# EAGLE design Power_Amp_carlos.2 (EAGLE 7.4.0)
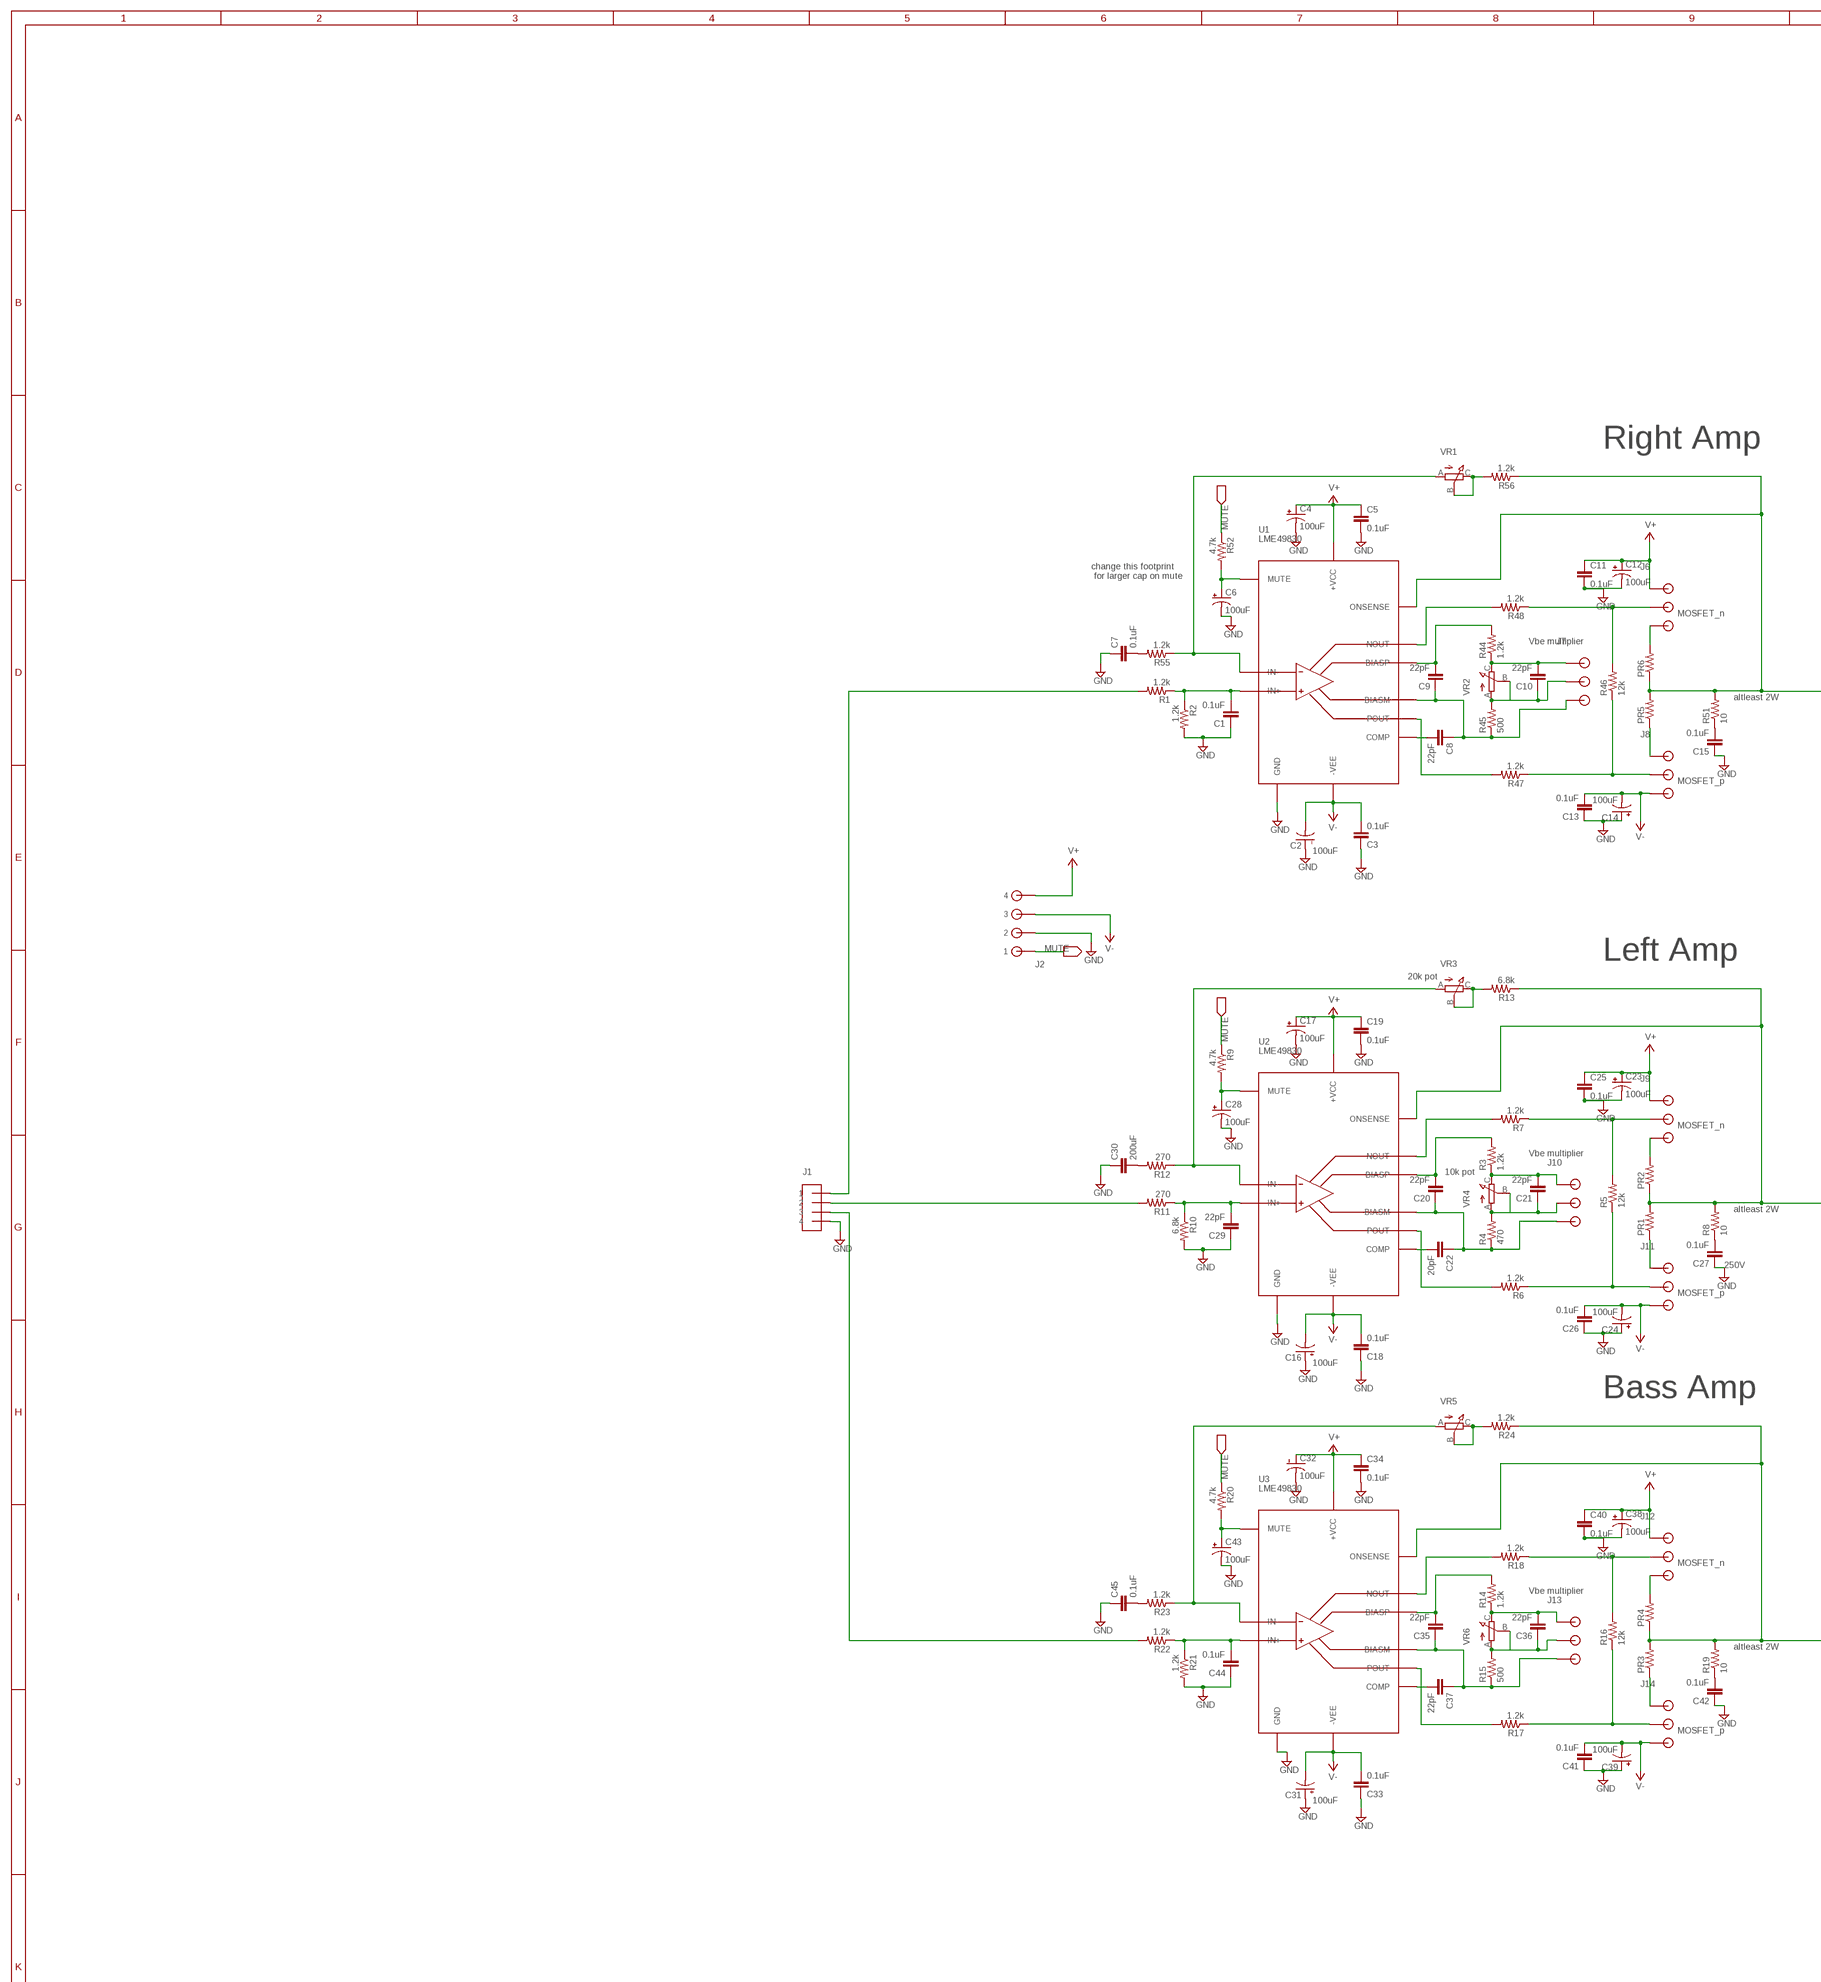
[diagram p0: schematic, sheet 1, part 1 of 3]
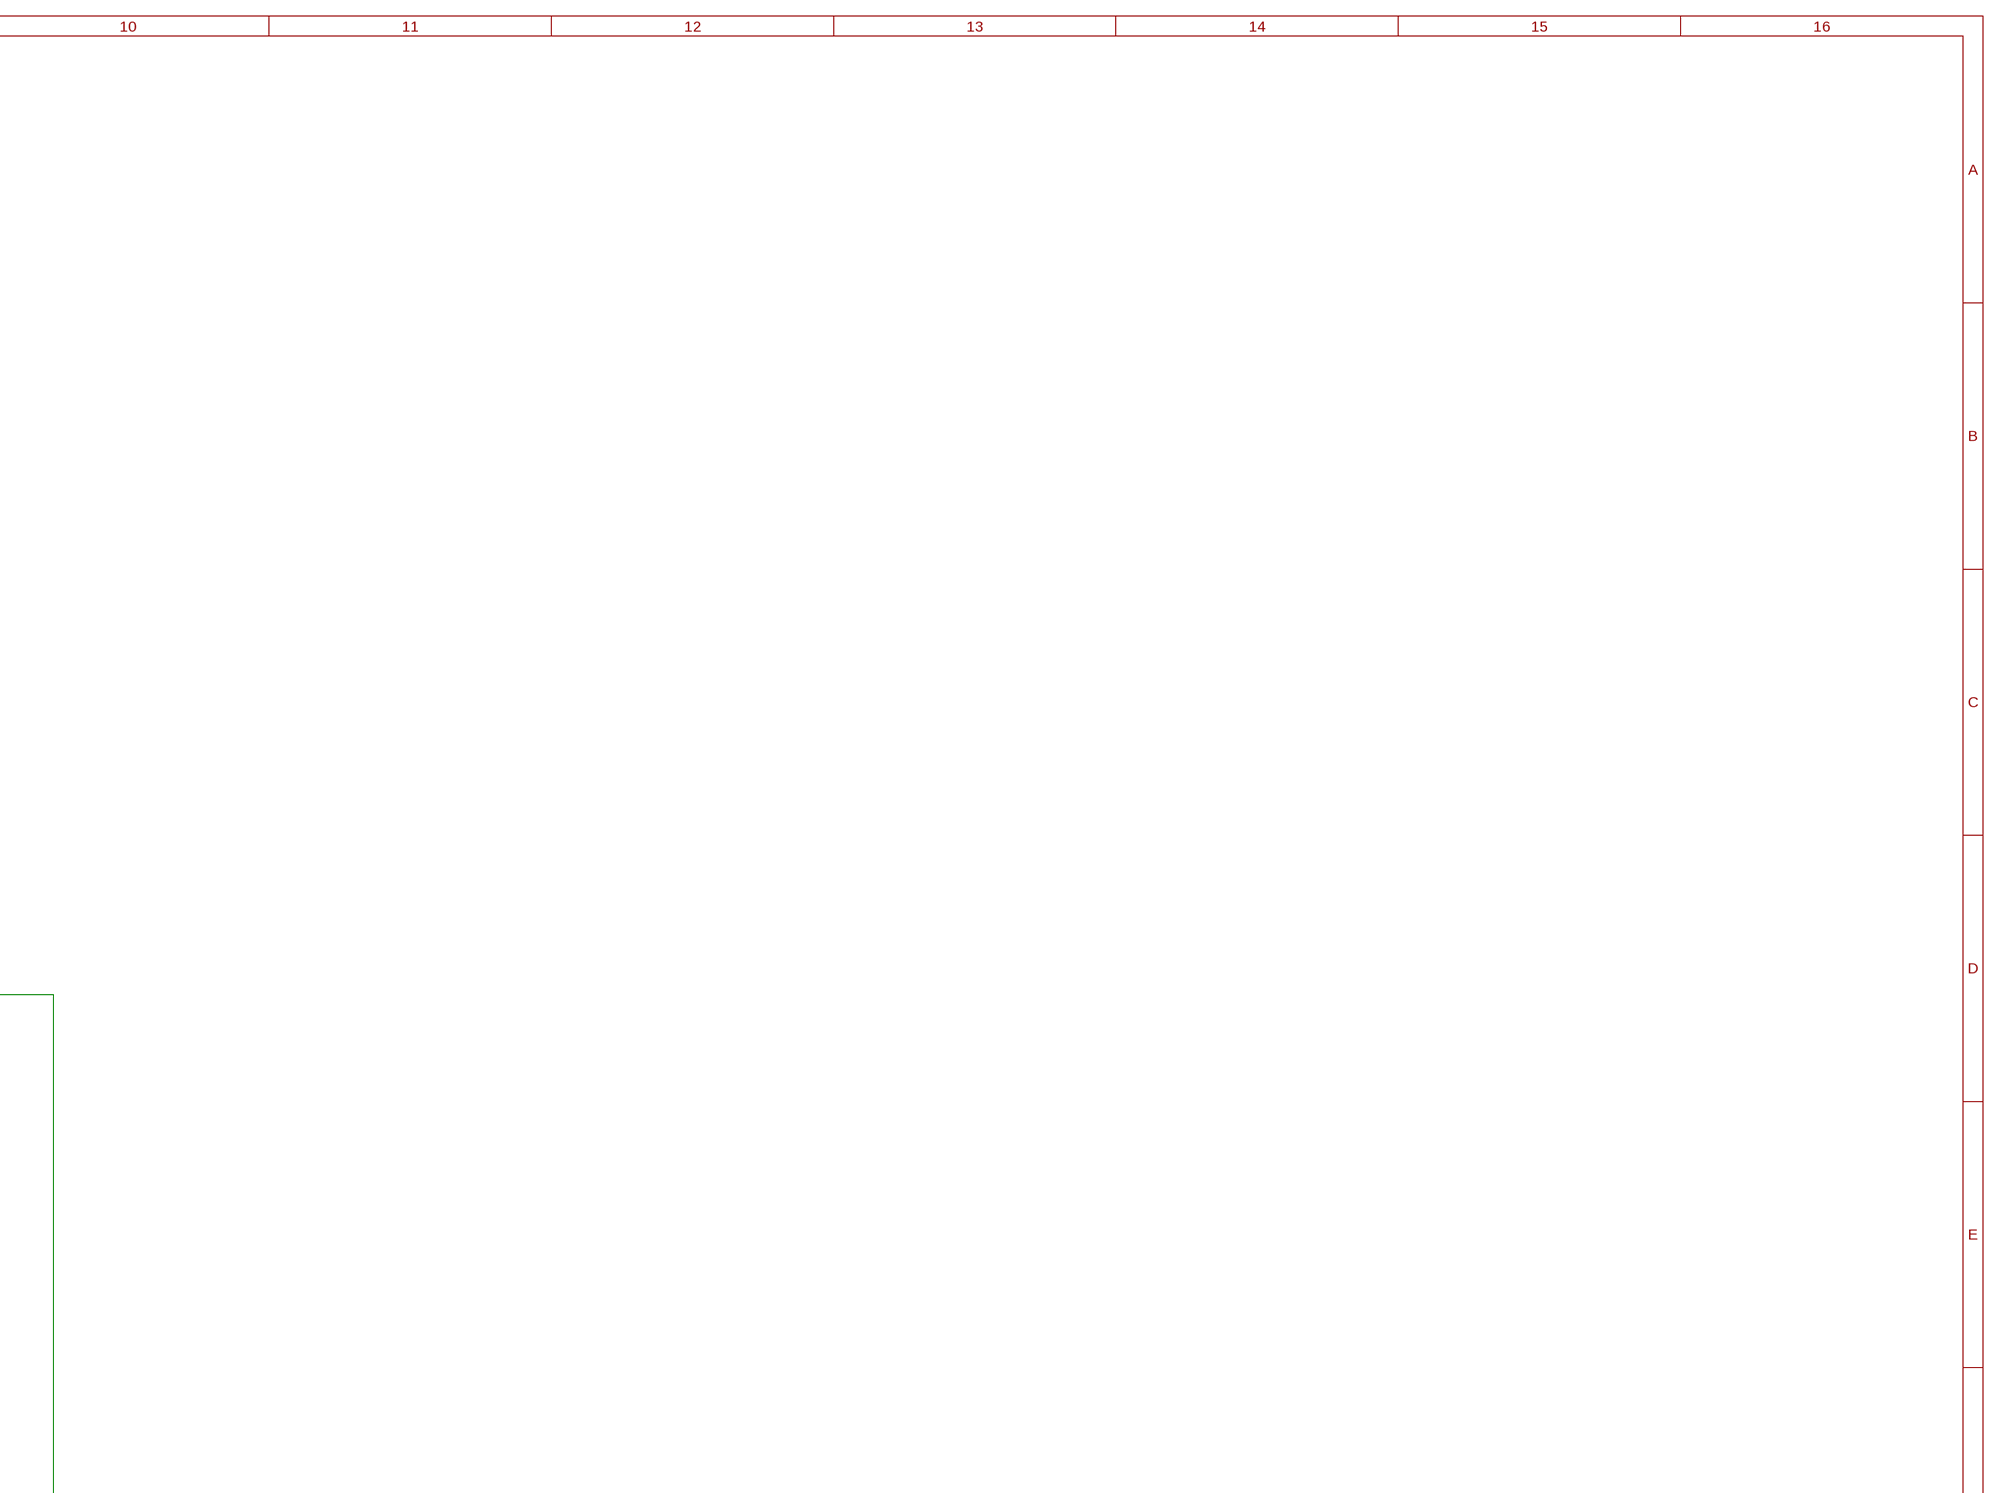
[diagram p1: schematic, sheet 1, part 2 of 3]
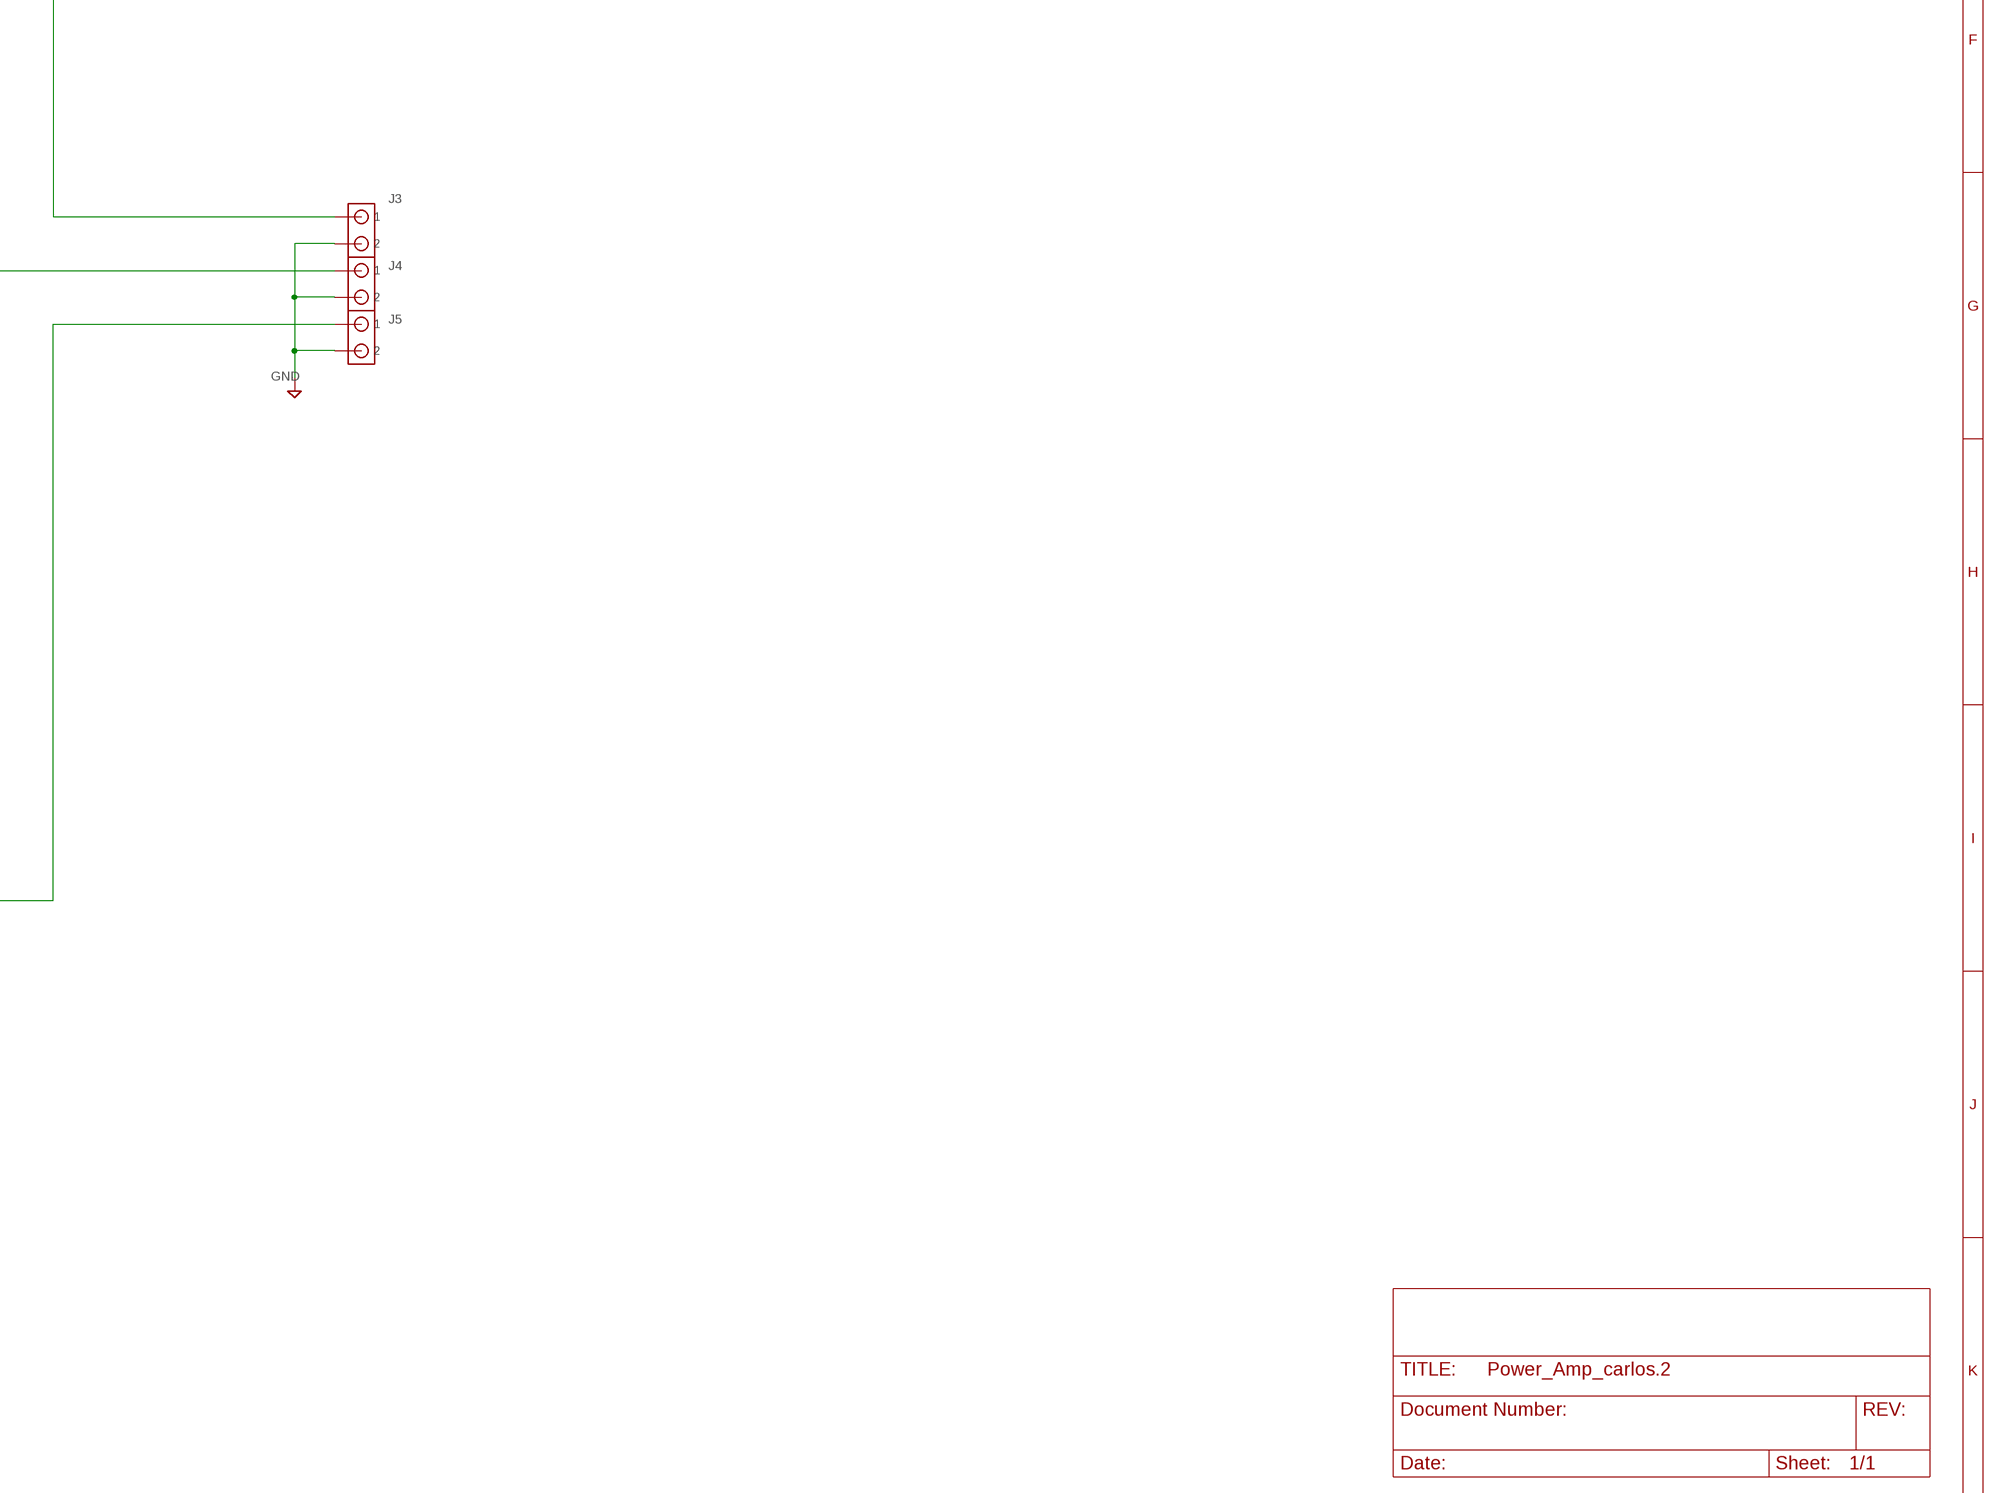
[diagram p2: schematic, sheet 1, part 3 of 3]

## Parts
C1  0.1uF  C-EU050-024X044  [C050-024X044]
C2  100uF  CPOL-USE2.5-6  [E2,5-6]
C3  0.1uF  C-EU050-024X044  [C050-024X044]
C4  100uF  CPOL-USE2.5-6  [E2,5-6]
C5  0.1uF  C-EU050-024X044  [C050-024X044]
C6  100uF  CPOL-USE2.5-6  [E2,5-6]
C7  0.1uF  C-EU050-024X044  [C050-024X044]
C8  22pF  C-EU050-024X044  [C050-024X044]
C9  22pF  C-EU050-024X044  [C050-024X044]
C10  22pF  C-EU050-024X044  [C050-024X044]
C11  0.1uF  C-EU050-024X044  [C050-024X044]
C12  100uF  CPOL-USE2.5-6  [E2,5-6]
C13  0.1uF  C-EU050-024X044  [C050-024X044]
C14  100uF  CPOL-USE2.5-6  [E2,5-6]
C15  0.1uF  C-EU050-024X044  [C050-024X044]
C16  100uF  CPOL-USE2.5-6  [E2,5-6]
C17  100uF  CPOL-USE2.5-6  [E2,5-6]
C18  0.1uF  C-EU050-024X044  [C050-024X044]
C19  0.1uF  C-EU050-024X044  [C050-024X044]
C20  22pF  C-EU050-024X044  [C050-024X044]
C21  22pF  C-EU050-024X044  [C050-024X044]
C22  20pF  C-EU050-024X044  [C050-024X044]
C23  100uF  CPOL-USE2.5-6  [E2,5-6]
C24  100uF  CPOL-USE2.5-6  [E2,5-6]
C25  0.1uF  C-EU050-024X044  [C050-024X044]
C26  0.1uF  C-EU050-024X044  [C050-024X044]
C27  0.1uF  C-EU050-024X044  [C050-024X044]
C28  100uF  CPOL-USE2.5-6  [E2,5-6]
C29  22pF  C-EU050-024X044  [C050-024X044]
C30  200uF  C-EU050-024X044  [C050-024X044]
C31  100uF  CPOL-USE2.5-6  [E2,5-6]
C32  100uF  CPOL-USE2.5-6  [E2,5-6]
C33  0.1uF  C-EU050-024X044  [C050-024X044]
C34  0.1uF  C-EU050-024X044  [C050-024X044]
C35  22pF  C-EU050-024X044  [C050-024X044]
C36  22pF  C-EU050-024X044  [C050-024X044]
C37  22pF  C-EU050-024X044  [C050-024X044]
C38  100uF  CPOL-USE2.5-6  [E2,5-6]
C39  100uF  CPOL-USE2.5-6  [E2,5-6]
C40  0.1uF  C-EU050-024X044  [C050-024X044]
C41  0.1uF  C-EU050-024X044  [C050-024X044]
C42  0.1uF  C-EU050-024X044  [C050-024X044]
C43  100uF  CPOL-USE2.5-6  [E2,5-6]
C44  0.1uF  C-EU050-024X044  [C050-024X044]
C45  0.1uF  C-EU050-024X044  [C050-024X044]
J1  4_PIN_AMPCONN  [4_PIN_AMPCON]
J2  1984633  [1984633]
J3  2TERMINAL_SPEAKER  [2TERMINAL_SPEAKER]
J4  2TERMINAL_SPEAKER  [2TERMINAL_SPEAKER]
J5  2TERMINAL_SPEAKER  [2TERMINAL_SPEAKER]
J6  OSTVN03A150  [OSTVN03A150]
J7  OSTVN03A150  [OSTVN03A150]
J8  OSTVN03A150  [OSTVN03A150]
J9  OSTVN03A150  [OSTVN03A150]
J10  OSTVN03A150  [OSTVN03A150]
J11  OSTVN03A150  [OSTVN03A150]
J12  OSTVN03A150  [OSTVN03A150]
J13  OSTVN03A150  [OSTVN03A150]
J14  OSTVN03A150  [OSTVN03A150]
PR1  R-US_0617/5V  [0617V]
PR2  R-US_0617/5V  [0617V]
PR3  R-US_0617/5V  [0617V]
PR4  R-US_0617/5V  [0617V]
PR5  R-US_0617/5V  [0617V]
PR6  R-US_0617/5V  [0617V]
R1  1.2k  R-US_0204/2V  [0204V]
R2  1.2k  R-US_0204/2V  [0204V]
R3  1.2k  R-US_0204/2V  [0204V]
R4  470  R-US_0204/2V  [0204V]
R5  12k  R-US_0204/2V  [0204V]
R6  1.2k  R-US_0204/2V  [0204V]
R7  1.2k  R-US_0204/2V  [0204V]
R8  10  R-US_0617/5V  [0617V]
R9  4.7k  R-US_0204/2V  [0204V]
R10  6.8k  R-US_0204/2V  [0204V]
R11  270  R-US_0204/2V  [0204V]
R12  270  R-US_0204/2V  [0204V]
R13  6.8k  R-US_0204/2V  [0204V]
R14  1.2k  R-US_0204/2V  [0204V]
R15  500  R-US_0204/2V  [0204V]
R16  12k  R-US_0204/2V  [0204V]
R17  1.2k  R-US_0204/2V  [0204V]
R18  1.2k  R-US_0204/2V  [0204V]
R19  10  R-US_0617/5V  [0617V]
R20  4.7k  R-US_0204/2V  [0204V]
R21  1.2k  R-US_0204/2V  [0204V]
R22  1.2k  R-US_0204/2V  [0204V]
R23  1.2k  R-US_0204/2V  [0204V]
R24  1.2k  R-US_0204/2V  [0204V]
R44  1.2k  R-US_0204/2V  [0204V]
R45  500  R-US_0204/2V  [0204V]
R46  12k  R-US_0204/2V  [0204V]
R47  1.2k  R-US_0204/2V  [0204V]
R48  1.2k  R-US_0204/2V  [0204V]
R51  10  R-US_0617/5V  [0617V]
R52  4.7k  R-US_0204/2V  [0204V]
R55  1.2k  R-US_0204/2V  [0204V]
R56  1.2k  R-US_0204/2V  [0204V]
U1  LME49830  [NDN0015A]
U2  LME49830  [NDN0015A]
U3  LME49830  [NDN0015A]
VR1  EVM2W  [EVM2W]
VR2  EVM2W  [EVM2W]
VR3  EVM2W  [EVM2W]
VR4  EVM2W  [EVM2W]
VR5  EVM2W  [EVM2W]
VR6  EVM2W  [EVM2W]

## Nets
BASS: J1.3 R22.2
GND: C1.1 C2.+ C3.1 C4.- C5.2 C6.- C7.1 C11.2 C12.- C13.1 C14.+ C15.1 C16.+ C17.- C18.1 C19.2 C23.- C24.+ C25.2 C26.1 C27.1 C28.- C29.1 C30.1 C31.+ C32.- C33.1 C34.2 C38.- C39.+ C40.2 C41.1 C42.1 C43.- C44.1 C45.1 J1.4 J2.P$2 J3.P$2 J4.P$2 J5.P$2 R2.2 R10.2 R21.2 U1.P3(GND) U2.P3(GND) U3.P3(GND)
LEFT: J1.2 R11.2
MUTE: J2.P$1 R9.1 R20.1 R52.1
N$1: C21.2 J10.P$1 R3.1 VR4.C
N$2: C21.1 J10.P$2 R4.2 VR4.A VR4.B
N$3: C20.2 R3.2 U2.P12(BIASP)
N$4: R48.2 U1.P14(NOUT)
N$5: C20.1 C22.1 J10.P$3 R4.1 U2.P11(BIASM)
N$6: C22.2 U2.P6(COMP)
N$7: R6.2 U2.P13(POUT)
N$8: J9.P$2 R5.2 R7.1
N$9: J11.P$2 R5.1 R6.1
N$11: J9.P$3 PR2.2
N$12: J4.P$1 PR1.2 PR2.1 R8.2 R13.1 U2.P$8(ONSENSE)
N$13: C27.2 R8.1
N$14: C28.+ R9.2 U2.P2(MUTE)
N$15: R7.2 U2.P14(NOUT)
N$16: C1.2 R1.1 R2.1 U1.P4(IN+)
N$17: C29.2 R10.1 R11.1 U2.P4(IN+)
N$18: C30.2 R12.2
N$19: R12.1 U2.P5(IN-) VR3.A
N$20: R13.2 VR3.B VR3.C
N$22: J11.P$1 PR1.1
N$23: C36.2 J13.P$1 R14.1 VR6.C
N$24: C36.1 J13.P$2 R15.2 VR6.A VR6.B
N$25: C35.2 R14.2 U3.P12(BIASP)
N$26: C35.1 C37.1 J13.P$3 R15.1 U3.P11(BIASM)
N$27: C37.2 U3.P6(COMP)
N$28: R17.2 U3.P13(POUT)
N$30: J12.P$2 R16.2 R18.1
N$31: R55.1 U1.P5(IN-) VR1.A
N$32: J14.P$2 R16.1 R17.1
N$33: J12.P$3 PR4.2
N$35: C42.2 R19.1
N$36: C7.2 R55.2
N$37: C43.+ R20.2 U3.P2(MUTE)
N$38: R18.2 U3.P14(NOUT)
N$39: C44.2 R21.1 R22.1 U3.P4(IN+)
N$40: R56.2 VR1.B VR1.C
N$41: C45.2 R23.2
N$42: R23.1 U3.P5(IN-) VR5.A
N$43: R24.2 VR5.B VR5.C
N$45: J14.P$1 PR3.1
N$65: C10.2 J7.P$1 R44.1 VR2.C
N$66: C8.2 U1.P6(COMP)
N$67: C8.1 C9.1 J7.P$3 R45.1 U1.P11(BIASM)
N$68: C10.1 J7.P$2 R45.2 VR2.A VR2.B
N$69: C9.2 R44.2 U1.P12(BIASP)
N$70: R47.2 U1.P13(POUT)
N$72: J6.P$2 R46.2 R48.1
N$73: J8.P$2 R46.1 R47.1
N$74: J6.P$3 PR6.2
N$75: J3.P$1 PR5.2 PR6.1 R51.2 R56.1 U1.P$8(ONSENSE)
N$77: J5.P$1 PR3.2 PR4.1 R19.2 R24.1 U3.P$8(ONSENSE)
N$84: C15.2 R51.1
N$85: C6.+ R52.2 U1.P2(MUTE)
N$110: J8.P$1 PR5.1
RIGHT: J1.1 R1.2
V+: C4.+ C5.1 C11.1 C12.+ C17.+ C19.1 C23.+ C25.1 C32.+ C34.1 C38.+ C40.1 J2.P$4 J6.P$1 J9.P$1 J12.P$1 U1.P15(+VCC) U2.P15(+VCC) U3.P15(+VCC)
V-: C2.- C3.2 C13.2 C14.- C16.- C18.2 C24.- C26.2 C31.- C33.2 C39.- C41.2 J2.P$3 J8.P$3 J11.P$3 J14.P$3 U1.P10(-VEE) U2.P10(-VEE) U3.P10(-VEE)

## Notes on the sheet
- Right Amp
- change this footprint
   for larger cap on mute
- MOSFET_n
- Vbe multiplier
- altleast 2W
- MOSFET_p
- Left Amp
- 20k pot
- MOSFET_n
- Vbe multiplier
- 10k pot
- altleast 2W
- 250V
- MOSFET_p
- Bass Amp
- MOSFET_n
- Vbe multiplier
- altleast 2W
- MOSFET_p

## Library data of the parts
C1 C3 C5 C7-C11 C13 C15 C18-C22 C25-C27 C29 C30 C33-C37 C40-C42 C44 C45 = rcl:C-EU: CAPACITOR, European symbol
C2 C4 C6 C12 C14 C16 C17 C23 C24 C28 C31 C32 C38 C39 C43 = rcl:CPOL-US: POLARIZED CAPACITOR, American symbol
J1 = Amplifier_Parts:4_PIN_AMPCONN
J2 = Amplifier_Parts:1984633
J3-J5 = Amplifier_Parts:2TERMINAL_SPEAKER
J6-J14 = Amplifier_Parts:OSTVN03A150
PR1-PR6 R1-R24 R44-R48 R51 R52 R55 R56 = rcl:R-US_: RESISTOR, American symbol
U1-U3 = LME49830_1:LME49830: Mono High Fidelity 200 Volt MOSFET Power Amplifier Input Stage with Mute Datasheet: http://www.ti.com/lit/ds/symlink/lme49830.pdf
VR1-VR6 = Amplifier_Parts:EVM2W

## Board
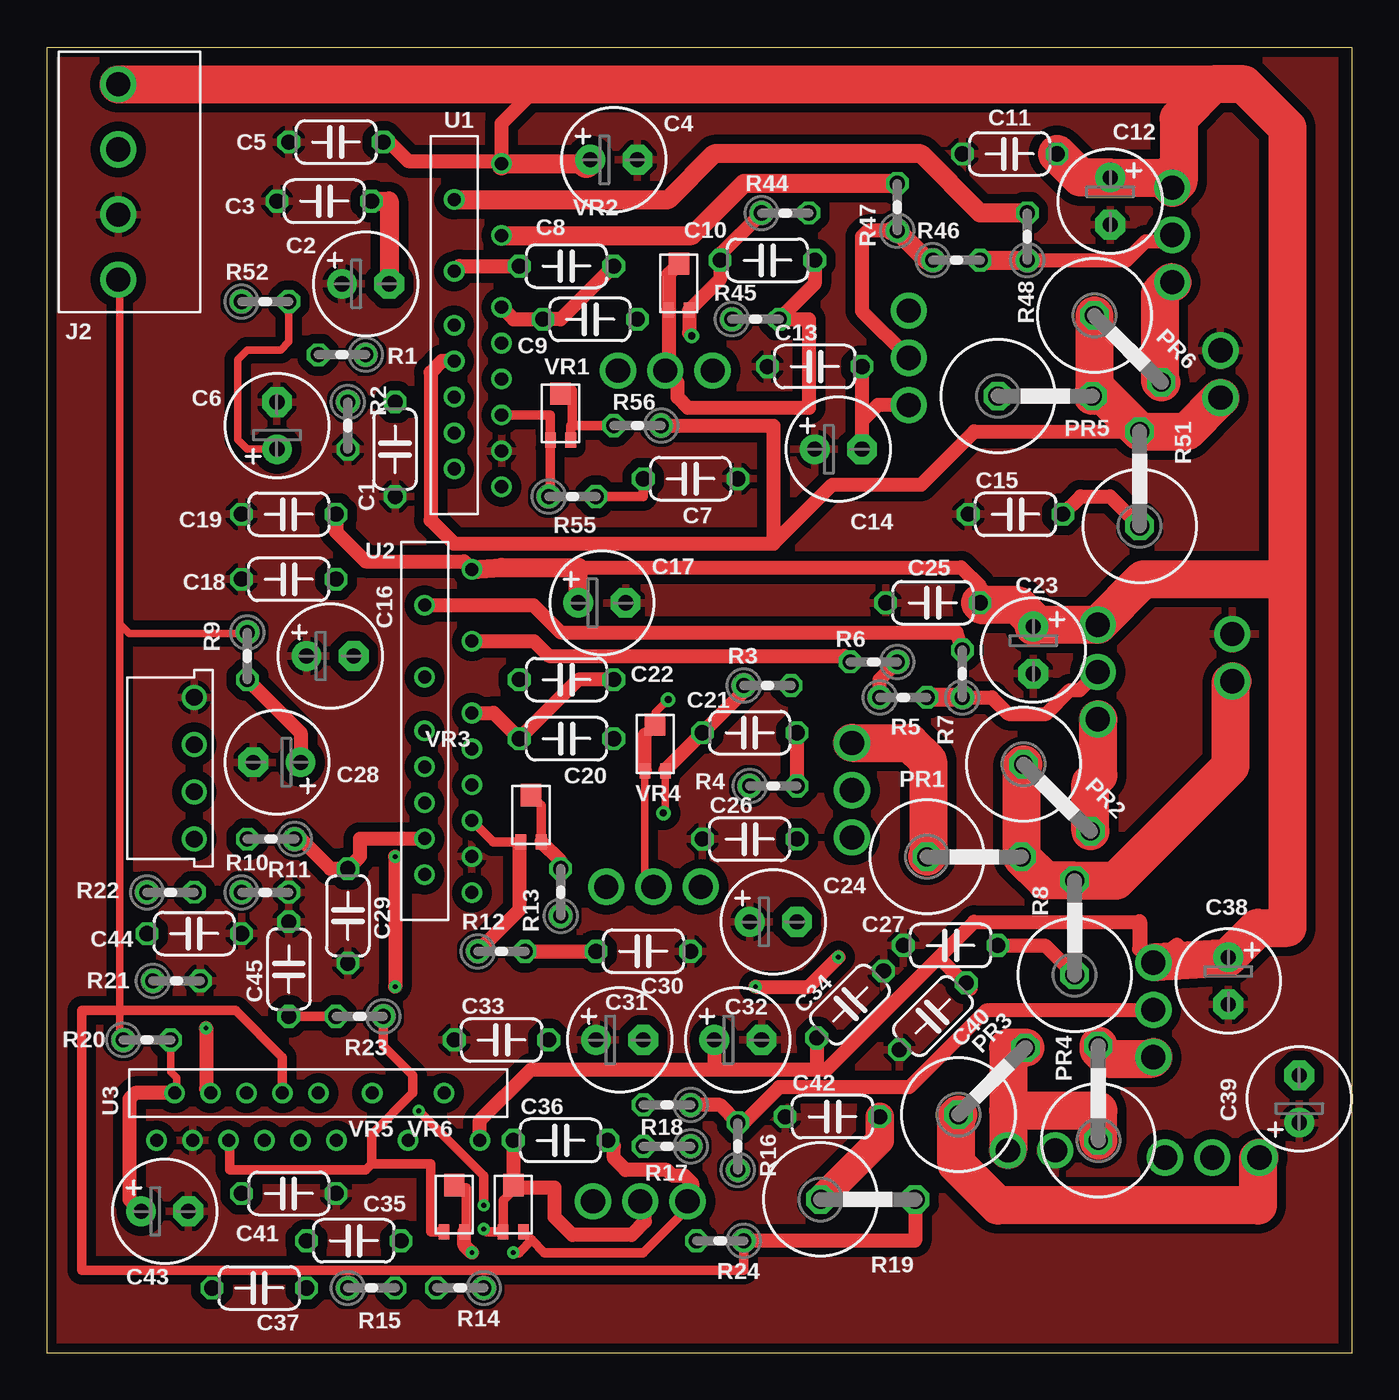
[diagram p3: board, top side]
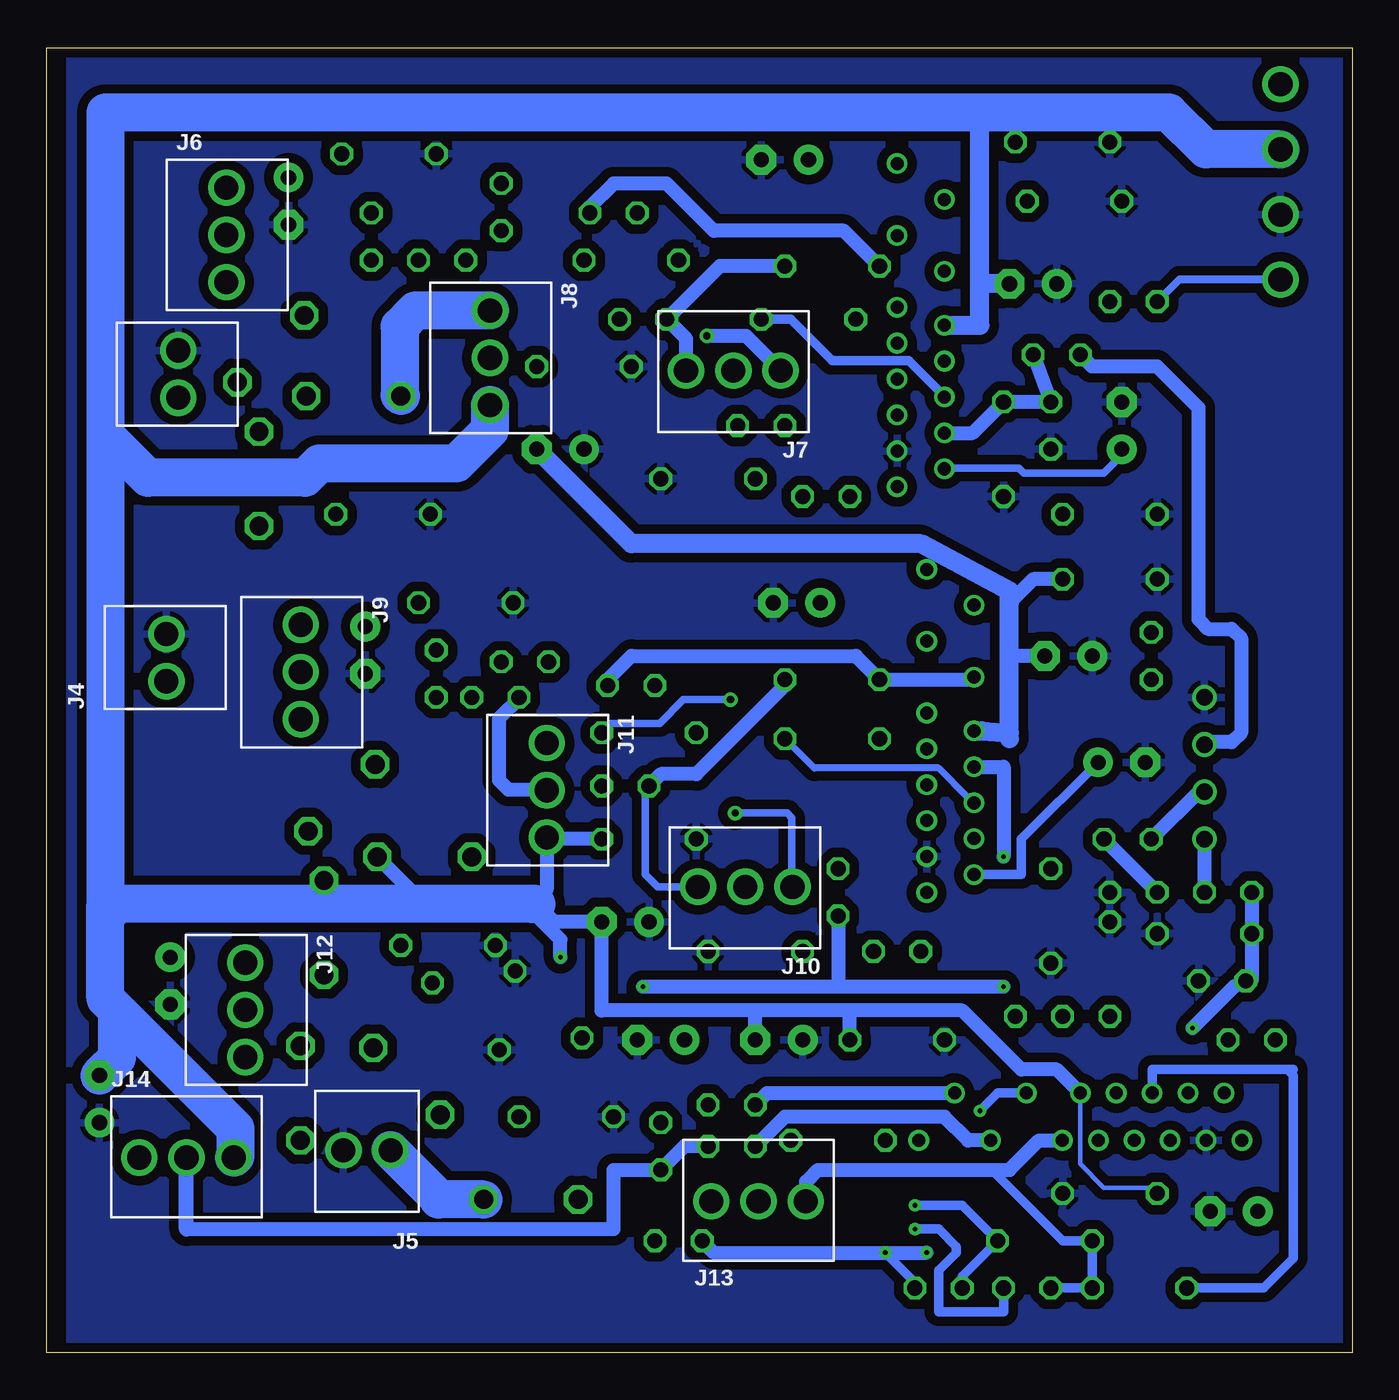
[diagram p4: board, bottom side, seen from below]

Size 70.16 x 70.16 mm. Coordinates in mm from the lower left corner, seen from the top.
Outline: 0,0 70.16,0 70.16,70.16 0,70.16 0,0
Copper layers (1*16): Top 0.0178mm / dielectric 59mil / Bottom 0.0178mm
Design rules "epl-lpkf": minimum track width 8mil, minimum drill 0.35mm, track to track 8mil, track to pad 8mil, pad to pad 8mil, via to via 8mil, smd to smd 8mil, copper to edge 15mil, drill to drill 15mil, minimum pad ring 8mil, minimum via ring 8mil, stop-mask expansion 3mil, vias tented up to drill 0mil, thermal gap 10mil

### Footprints (pad centres in the part's own frame; a part is rotated, then mirrored left to right if it is on the bottom)
C050-024X044 = drill 0.813 octagon: 1 -2.54,0; 2 2.54,0
E2,5-6 = drill 0.813 pad 1.6: + -1.27,0 | drill 0.813 pad 1.6 octagon: - 1.27,0
4_PIN_AMPCON = drill 0.89: 1 1.27,0; 2 -1.27,0; 3 -3.81,0; 4 3.81,0
1984633 = drill 1.3: P$1 1.75,4.4; P$2 5.25,4.4; P$3 8.75,4.4; P$4 12.25,4.4
2TERMINAL_SPEAKER = drill 1.3: P$1 1.5,3.2; P$2 4.04,3.2
OSTVN03A150 = drill 1.3: P$1 1.5,3.2; P$2 4.04,3.2; P$3 6.58,3.2
0617V = drill 1.016 octagon: 1 -2.54,0; 2 2.54,0
0204V = drill 0.813 octagon: 1 -1.27,0; 2 1.27,0
NDN0015A = drill 0.7: P1 5.08,-8.685; P2 2.54,-7.72; P3 5.08,-6.755; P4 2.54,-5.79; P5 5.08,-4.825; P6 2.54,-3.86; P7 5.08,-2.895; P9 5.08,-0.965; P10 2.54,0; P11 5.08,0.965; P12 2.54,2.895; P13 5.08,4.825; P14 2.54,6.755; P15 5.08,8.685; P$8 2.54,-1.93
EVM2W = smd 0.575 x 0.8: A -0.55,-1.1; C 0.55,-1.1 | smd 1.1 x 1.2: B 0,1.4

### Placement (x,y rotation side)
C1  18.73,48.58 90 top
C2  17.14,57.47 0 top
C3  14.92,61.91 0 top
C4  30.48,64.14 0 top
C5  15.56,65.09 180 top
C6  12.38,49.85 90 top
C7  34.61,46.99 180 top
C8  29.21,55.56 0 top
C9  27.94,58.42 180 top
C10  38.73,58.74 180 top
C11  51.75,64.45 180 top
C12  57.15,61.91 270 top
C13  41.27,53.02 0 top
C14  42.55,48.58 0 top
C15  52.07,45.09 0 top
C16  15.24,37.46 0 top
C17  29.84,40.32 0 top
C18  13.02,41.59 0 top
C19  13.02,45.09 180 top
C20  27.94,36.2 180 top
C21  37.78,33.34 180 top
C22  27.94,33.02 0 top
C23  53.02,37.78 270 top
C24  39.05,23.18 0 top
C25  47.62,40.32 180 top
C26  37.78,27.62 0 top
C27  48.58,21.91 0 top
C28  12.38,31.75 180 top
C29  16.19,23.5 90 top
C30  32.07,21.59 180 top
C31  30.8,16.83 0 top
C32  37.15,16.83 0 top
C33  24.45,16.83 0 top
C34  43.18,18.73 45 top
C35  16.51,6.03 0 top
C36  27.62,11.43 0 top
C37  11.43,3.49 180 top
C38  63.5,20 270 top
C39  67.31,13.65 90 top
C40  47.62,18.1 225 top
C41  13.02,8.57 180 top
C42  42.23,12.7 0 top
C43  6.35,7.62 0 top
C44  7.94,22.54 180 top
C45  13.02,20.64 270 top
J1  7.94,31.43 90 top
J2  8.25,55.94 90 top
J3  59.88,49.85 90 bottom
J4  60.52,34.61 90 bottom
J5  50.16,14.1 180 bottom
J6  63.69,64.14 270 bottom
J7  29.21,56.01 180 bottom
J8  49.53,57.53 270 bottom
J9  59.69,40.64 270 bottom
J10  28.57,28.26 180 bottom
J11  46.48,34.29 270 bottom
J12  62.67,22.48 270 bottom
J13  35.94,4.95 0 bottom
J14  66.68,7.3 0 bottom
PR1  49.85,26.67 0 top
PR2  54.29,29.84 315 top
PR3  50.8,14.6 45 top
PR4  56.51,13.97 90 top
PR5  53.66,51.44 0 top
PR6  58.1,53.98 315 top
R1  15.88,53.66 180 top
R2  16.19,49.85 270 top
R3  38.73,35.88 0 top
R4  39.05,30.48 0 top
R5  46.04,35.24 0 top
R6  44.45,37.15 180 top
R7  49.21,36.51 90 top
R8  55.24,22.86 90 top
R9  10.79,37.46 270 top
R10  11.75,24.77 0 top
R11  12.06,27.62 180 top
R12  24.45,21.59 0 top
R13  27.62,24.77 90 top
R14  22.23,3.49 180 top
R15  17.46,3.49 0 top
R16  37.15,11.11 90 top
R17  33.34,11.11 180 top
R18  33.34,13.33 180 top
R19  44.13,8.25 0 top
R20  5.4,16.83 0 top
R21  6.98,20 0 top
R22  6.67,24.77 0 top
R23  16.83,18.1 180 top
R24  36.2,6.03 180 top
R44  39.69,61.28 0 top
R45  38.1,55.56 0 top
R46  48.89,58.74 0 top
R47  45.72,61.59 90 top
R48  52.71,60.01 90 top
R51  58.74,46.99 90 top
R52  11.75,56.52 0 top
R55  28.26,46.04 0 top
R56  31.75,49.85 180 top
U1  19.37,55.24 0 top
U2  17.78,33.44 0 top
U3  14.61,16.51 270 top
VR1  27.62,50.16 0 top
VR2  33.97,57.15 0 top
VR3  26.03,28.57 0 top
VR4  32.7,32.38 0 top
VR5  21.91,7.62 0 top
VR6  25.08,7.62 0 top

### Tracks (layer width: path | path; a pad name or v marks a point on that pad's centre or on a via)
BASS
  Bottom 0.762: J1.3 R22.2
GND
  pour Top (isolate 0.508): 0.32,-0.32 69.22,-0.95 69.22,70.17 0.32,70.8
  pour Bottom (isolate 0.508): 0.32,-0.64 68.9,-0.95 68.9,70.17 0.32,70.48
LEFT
  Bottom 0.762: J1.2 8.25,30.16 R11.2
MUTE
  Top 0.406: R9.1 10.73,38.67 4.45,38.67 3.94,39.18 | 3.94,39.18 3.94,17.02 R20.1 | 3.94,39.18 3.94,57.61 J2.P$1
  Bottom 0.406: J2.P$1 9.3,57.69 R52.1 9.27,57.72 3.94,57.72
N$1  (via drill 0.38)
  Top 0.406: VR4.C 33.25,29.13 v33.15,29.02
  Top 0.762: R3.1 37.46,35.56 C21.2 33.25,31.35 VR4.C
  Bottom 0.406: v33.15,29.02 30.35,29.02 30.1,28.77 30.1,25.08 J10.P$1
N$2  (via drill 0.38)
  Top 0.381: 32.15,33.24 VR4.B
  Top 0.406: VR4.A 32.13,31.28 32.13,25.54 J10.P$2 | VR4.B 32.7,34.42 v33.4,35.12
  Top 0.762: VR4.A 32.15,33.24 | C21.1 R4.2
  Bottom 0.406: v33.4,35.12 35.94,35.12 37.21,33.85 39.81,33.85 C21.1
N$3
  Bottom 0.762: R3.2 40.01,36.2 38.73,37.46 26.67,37.46 C20.2 20.46,36.2 U2.P12
N$4
  Top 1.016: U1.P14 33.42,62 35.88,64.45 46.99,64.45 50.16,61.28 R48.2
N$5
  Top 0.762: U2.P11 24.02,34.4 C22.1 28.57,36.2 C20.1
  Bottom 0.406: J10.P$3 37.31,25.06 37.97,25.72 37.97,30.29 R4.1
  Bottom 0.762: C20.1 30.48,35.88 35.24,31.12 37.15,31.12 R4.1
N$6
  Bottom 0.381: 20.32,29.84 20.64,29.84 22.23,31.43 28.89,31.43 C22.2
  Bottom 0.508: U2.P6 20.32,29.84
N$7
  Top 0.762: U2.P13 26.19,38.26 26.99,37.46 42.86,37.46 R6.2
N$8
  Top 0.762: R7.1 50.8,35.24 51.69,34.35 53.72,34.35 54.99,35.62 55.51,35.62 J9.P$2
  Top 1.016: R7.1 R5.2
N$9
  Top 0.762: R5.1 44.77,36.2 R6.1
  Bottom 0.762: R5.1 44.77,35.18 45.85,34.1 45.85,30.8 45.34,30.29 43.32,30.29 J11.P$2
N$11
  Top 2.032: PR2.2 56.09,30.63 56.51,31.05 56.51,34.03 J9.P$3
N$12  (via drill 0.25)
  Top 0.762: v18.73,26.67 v18.73,19.68 | v38.1,19.68 40.96,19.68 v42.55,21.27
  Top 2.032: PR2.1 52.39,31.53 PR1.2 53.66,25.4 R8.2 57.47,25.4 63.63,31.56 63.63,36.02 J4.P$1
  Bottom 0.762: v18.73,19.68 27.62,19.68 | R13.1 27.62,19.68 | PR1.2 49.85,24.13 44.45,24.13 42.55,22.22 v42.55,21.27 | U2.P$8 18.73,31.51 v18.73,26.67 | 27.62,19.68 v38.1,19.68
N$13
  Top 0.762: C27.2 53.66,21.91 R8.1
N$14
  Top 0.762: R9.2 13.65,33.34 C28.+
  Bottom 0.508: U2.P2 17.78,25.72 17.78,27.62 C28.+
N$15
  Top 0.762: R7.2 48.89,38.74 27.62,38.74 26.16,40.19 U2.P14
N$16
  Bottom 0.762: R1.1 R2.1 C1.2 20.39,49.45 U1.P4
N$17
  Top 0.762: R11.1 13.65,27.62 15.24,26.04 C29.2 16.85,26.7 16.85,27.65 U2.P4
  Bottom 0.762: R11.1 R10.1
N$18
  Top 0.762: R12.2 C30.2
N$19
  Top 0.508: 25.4,27.39 VR3.A 24,27.47 U2.P5
  Top 0.762: 25.4,27.39 25.4,23.81 R12.1
N$20
  Top 0.508: VR3.C 26.59,29.43 VR3.B
  Top 0.762: R13.2 27.62,26.44 VR3.C
N$22
  Top 2.032: J11.P$1 46.39,32.79 47.37,31.81 47.37,26.73 PR1.1
N$23  (via drill 0.25)
  Top 0.508: VR6.C 26.08,6.07 | 26.08,6.07 26.76,5.4 32.07,5.4 34.7,8.02 | v25.08,5.4 25.4,5.4 26.08,6.07
  Top 0.762: C36.2 30.48,11.11 30.48,10.48 31.12,9.84 33.34,9.84 33.66,9.52 34.29,9.52 34.7,9.12 34.7,8.41 J13.P$1 34.57,8.02 34.7,8.02
  Bottom 0.508: R14.1 23.49,3.81 v25.08,5.4
N$24  (via drill 0.25)
  Top 0.508: 25.21,8.89 24.53,8.21 VR6.A 23.64,6.52 v23.49,6.67
  Top 0.762: C36.1 VR6.B 25.21,8.89 27.3,8.89 27.3,7.3 28.26,6.35 31.43,6.35 32.16,7.07 32.16,7.9 J13.P$2
  Bottom 0.508: v23.49,6.67 22.23,6.67 21.27,5.72 21.27,5.4 22.23,4.44 22.23,2.22 18.73,2.22 R15.2
N$25  (via drill 0.25)
  Top 0.508: v20,13.02 23.49,9.52 v23.49,7.94
  Bottom 0.508: U3.P12 19.05,13.97 v20,13.02 | v23.49,7.94 20.95,7.94 C35.2 20.95,4.13 R14.2
N$26
  Bottom 0.508: 19.37,9.84 15.56,6.03 C35.1 C37.1 R15.1
  Bottom 0.762: U3.P11 16.83,11.43 18.41,9.84 19.37,9.84 28.7,9.84 29.34,9.21 29.34,8.18 J13.P$3
N$27
  Bottom 0.508: U3.P6 10.74,15.24 3.49,15.24 | 3.49,15.24 3.18,15.24 | C37.2 4.76,3.49 3.18,5.08 3.18,14.92 3.49,15.24
N$28
  Bottom 0.762: U3.P13 20.64,11.43 21.91,12.7 30.48,12.7 R17.2
N$30
  Top 0.406: 59.17,18.41 59.45,18.41 J12.P$2
  Top 0.762: 59.17,18.41 50.48,18.41 46.35,14.29 39.37,14.29 37.46,12.38 R16.2 36.2,13.33 R18.1
N$31
  Top 0.508: U1.P5 27.07,50.42 VR1.A 27.07,46.04 R55.1
N$32
  Bottom 0.762: R17.1 35.88,11.11 R16.1 39.69,9.84 39.69,6.67 62.63,6.67
  Bottom 0.813: 62.63,6.67 J14.P$2
N$33
  Top 2.032: PR4.2 56.51,16.32 57.02,15.81 59.39,15.81 J12.P$3
N$35
  Top 1.524: R19.1 44.77,11.43 C42.2
N$36
  Top 0.508: R55.2 32.07,46.04 C7.2
N$37
  Top 0.406: R20.2 6.67,15.11 6.98,14.8 6.98,14.07 U3.P2
  Top 0.762: U3.P2 4.76,13.97 4.45,13.65 4.45,8.25 C43.+
N$38
  Bottom 0.762: R18.2 31.43,13.97 U3.P14
N$39  (via drill 0.25)
  Top 0.762: v8.57,17.46 8.57,14.21 U3.P4
  Bottom 0.762: R22.1 C44.2 5.4,20 R21.1 6.35,19.68 v8.57,17.46
N$40
  Top 0.508: R56.2 28.26,49.85 | VR1.C 28.17,49.85 28.26,49.85 | 28.26,49.85 28.26,51.75 27.62,51.75 VR1.B
N$41
  Top 0.508: C45.2 R23.2
N$42
  Top 0.508: R23.1 18.1,16.51 19.69,14.92 19.69,13.97 17.46,11.75 17.46,10.16 | 17.46,10.16 17.14,9.84 9.84,9.84 9.84,11.37 U3.P5 | VR5.A 20.64,6.52 20.64,10.16 17.46,10.16
N$43  (via drill 0.25)
  Top 0.508: VR5.C 22.54,6.52 22.54,8.89 21.91,8.89 VR5.B
  Top 0.762: v22.86,5.4 22.46,5.8 VR5.C
  Bottom 0.762: R24.2 34.29,5.4 v22.86,5.4
N$45
  Top 2.032: PR3.1 48.89,12.7 48.89,10.16 51.12,7.94 65.09,7.94 65.09,10.45 J14.P$1
N$65  (via drill 0.38)
  Top 0.762: R44.1 36.2,59.06 C10.2 36.2,57.72 VR2.C 34.52,54.82 v34.67,54.67
  Bottom 0.762: v34.67,54.67 32.58,54.67 J7.P$1
N$66
  Bottom 0.508: 21.91,51.44 23.81,53.34 27.94,53.34 30.16,55.56 C8.2
  Bottom 1.016: U1.P6 21.91,51.44
N$67
  Top 0.762: U1.P11 25.09,55.56 C8.1 27.62,55.56 C9.1
  Bottom 0.762: C9.1 33.97,58.42 R45.1 35.79,54.52 J7.P$3
N$68
  Top 0.762: C10.1 41.27,57.47 R45.2 40.96,55.56 40.96,50.8 34.48,50.8 33.91,51.37 33.91,52.15 J7.P$2 33.42,52.98 VR2.A 33.42,58 VR2.B
N$69
  Top 0.762: U1.P12 22.19,58.42 C9.2
  Bottom 0.762: C9.2 27.3,60.33 34.29,60.33 36.83,62.87 39.69,62.87 40.96,61.59 R44.2
N$70
  Top 1.016: U1.P13 34.67,60.07 37.46,62.87 R47.2
N$72
  Top 0.762: R48.1 58.04,58.74 59.05,59.75 60.15,59.75 J6.P$2
  Top 1.016: R46.2 R48.1
N$73
  Top 0.762: 45.4,60.33 44.13,60.33 43.81,60.01 43.81,56.01 J8.P$2
  Top 1.016: R46.1 47.31,58.74 R47.1 45.4,60.33
N$74
  Top 2.032: J6.P$3 60.41,57.56 59.82,56.96 59.82,52.26 PR6.2
N$75
  Top 0.762: U1.P$8 21.25,53.31 20.64,52.7 20.64,44.77 21.91,43.5 39.05,43.5 | R56.1 39.05,49.85 39.05,43.5 | 39.05,43.5 42.23,46.67 46.99,46.67 49.85,49.53 R51.2
  Top 2.032: PR6.1 56.31,51.54 | 56.31,51.54 PR5.2 | 56.31,51.54 56.72,51.54 R51.2 61.26,49.53 J3.P$1
N$77
  Top 0.508: U3.P$8 12.68,15.9 10.16,18.41 1.9,18.41 1.9,4.44 37.46,4.44 R24.1
  Top 0.762: R19.2 46.67,6.03 R24.1
  Top 2.032: PR3.2 51.66,16.4 51.66,13.02 | PR4.1 56.51,13.02 51.66,13.02 | 51.66,13.02 J5.P$1
  Bottom 2.032: R19.2 49.1,8.25 49.1,8.33 J5.P$1
N$84
  Top 0.762: C15.2 55.56,46.04 57.15,46.04 R51.1
N$85
  Top 0.406: R52.2 13.02,54.36 12.57,53.91 10.79,53.91 10.29,53.4 10.29,49.09 10.79,48.58 C6.+
  Bottom 0.406: C6.+ 12.38,48.26 13.34,47.31 17.65,47.31 17.91,47.56 21.87,47.56 U1.P2
N$110
  Bottom 2.032: J8.P$1 50.33,56.03 51.18,55.18 51.18,51.5 PR5.1
RIGHT
  Bottom 0.762: R1.2 13.97,53.02 10.48,53.02 8.25,50.8 8.25,39.43 7.75,38.93 6.48,38.93 5.97,38.42 5.97,33.34 6.48,32.83 7.81,32.83 J1.1
V+
  Top 0.762: C19.1 15.56,44.13 17.14,42.55 22.44,42.55 U2.P15 | U3.P15 23.29,12.49 26.03,15.24 35.88,15.24 | 35.88,15.24 41.59,15.24 | 41.59,15.24 41.91,15.24 47.94,21.27 | 47.94,21.27 49.85,23.18 58.74,23.18 | C32.+ 35.88,15.24 | C34.1 41.38,15.45 41.59,15.24 | C40.1 49.64,19.58 47.94,21.27 | 26.54,68.19 24.45,66.1 U1.P15 24.31,64.07 19.43,64.07 18.41,65.09 C5.1 | 28.57,42.23 49.15,42.23 50.16,41.21 C25.1
  Top 0.813: 58.74,23.18 58.74,21.72 J12.P$1 60.75,21.92 59.61,21.02
  Top 1.016: 29.01,63.93 U1.P15 24.45,63.82 | U2.P15 24.45,42.23 28.57,42.23 C17.+
  Top 1.524: 29.01,63.93 C4.+
  Top 2.032: 66.68,41.59 66.68,65.85 64.33,68.19 62.67,68.19 | C11.1 55.56,63.18 C12.+ 59.94,63.18 J6.P$1 60.83,62.98 60.83,66.36 62.67,68.19 | 66.68,41.59 58.94,41.59 J9.P$1 53.11,39.14 C23.+ 53.02,39.37 52.2,40.2 50.29,40.2 C25.1 | 66.68,41.59 66.68,22.86 65.09,22.86 C38.+ 59.61,21.02 | J2.P$4 26.54,68.19 62.67,68.19
V-
  Top 0.762: C13.2 43.81,50.1 | 43.81,50.1 C14.- | J8.P$3 44.66,50.95 43.81,50.1
  Top 1.016: C3.2 18.41,61.91 C2.-
  Bottom 0.254: U3.P10 14.61,10.16 13.34,8.89 10.79,8.89 C41.2
  Bottom 0.762: C18.2 17.14,41.59 18.41,40.32 | C16.- 18.41,37.46 | 43.81,24.13 42.86,23.18 C24.- 40.32,18.41 32.07,18.41 | U3.P10 15.88,15.24 17.78,15.24 20.95,18.41 26.99,18.41 | 26.99,18.41 32.07,18.41 | C33.2 26.99,18.41 | C31.- 32.07,18.41 | C26.2 43.19,27.62 J11.P$3 43.28,24.92 44.07,24.13
  Bottom 1.016: U1.P10 20,55.24 20,57.47 | 20,57.47 20,66.67 | 18.41,33.02 18.41,33.34 | 18.41,33.34 18.41,37.46 18.41,40.32 18.41,40.96 23.18,43.5 38.73,43.5 C14.- | U2.P10 19.9,33.44 18.41,33.34 | C2.- 20,57.47
  Bottom 2.032: 66.99,49.34 66.99,66.67 20,66.67 9.84,66.67 7.86,64.69 J2.P$3 | 66.99,49.34 66.99,24.13 | 43.81,24.13 44.07,24.13 66.36,24.13 | 66.36,24.13 66.99,24.13 | 66.68,23.81 66.36,24.13 | 66.36,18.41 60.01,12.07 60.01,10.59 J14.P$3 | 66.36,18.41 66.99,19.05 66.99,24.13 | C39.- 66.36,15.88 66.36,18.41 | J8.P$3 46.33,49.62 48.13,47.82 55.5,47.82 56.26,47.05 64.71,47.05 66.99,49.34